# Altium schematic sheet sensors.SchDoc: Sensors
size A4; SheetNumber: 5; SheetTotal: 6
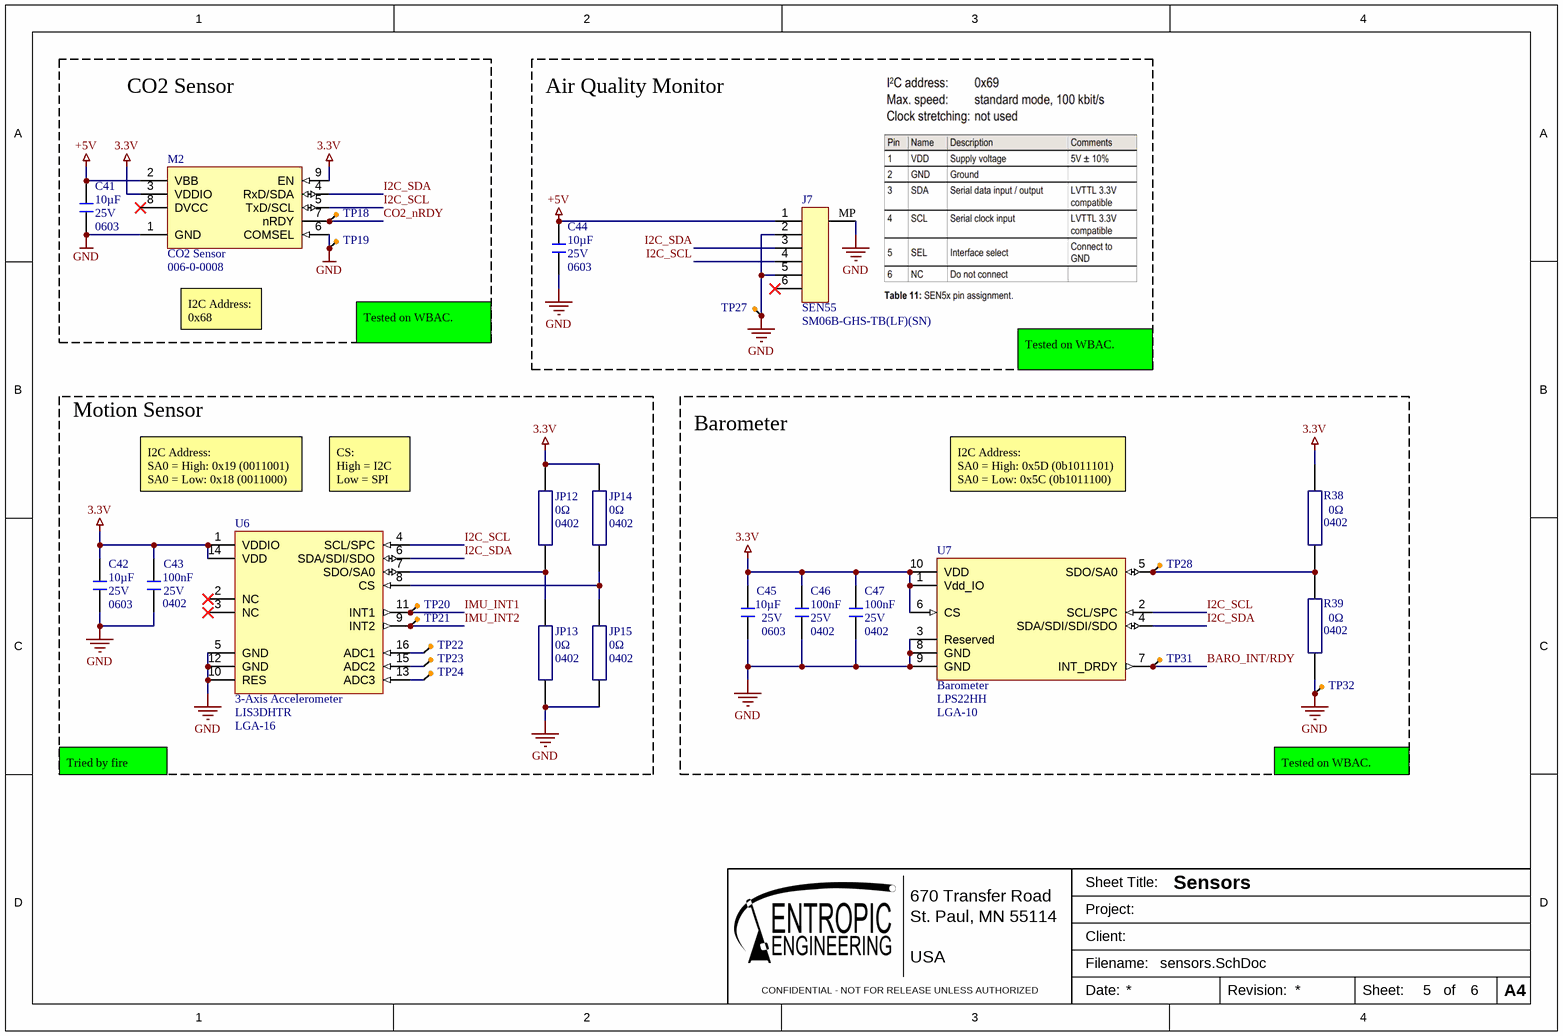
[diagram p0: sensors.SchDoc]

## Parts
C41  value 10µF  Case/Package: 0603  Voltage Rating: 25V  [0603_capacitor]  (hidden comment: CL10A106MA8NRNC)
C42  value 10µF  Case/Package: 0603  Voltage Rating: 25V  [0603_capacitor]  (hidden comment: CL10A106MA8NRNC)
C43  Case Code (Imperial): 0402  Voltage: 25V  Capacitance: 100nF  [0402_capacitor]  (hidden comment: GRM155R71E104KE14D)
C44  value 10µF  Case/Package: 0603  Voltage Rating: 25V  [0603_capacitor]  (hidden comment: CL10A106MA8NRNC)
C45  value 10µF  Voltage Rating: 25V  Case/Package: 0603  [0603_capacitor]  (hidden comment: CL10A106MA8NRNC)
C46  Case Code (Imperial): 0402  Voltage: 25V  Capacitance: 100nF  [0402_capacitor]  (hidden comment: GRM155R71E104KE14D)
C47  Case Code (Imperial): 0402  Voltage: 25V  Capacitance: 100nF  [0402_capacitor]  (hidden comment: GRM155R71E104KE14D)
J7  SEN55  [SM06B-GHS-TB]
JP12  value 0Ω  Case/Package: 0402  [0402_resistor]  (hidden comment: RC0402FR-070RL)
JP13  value 0Ω  Case/Package: 0402  [0402_resistor]  (hidden comment: RC0402FR-070RL)
JP14  value 0Ω  Case/Package: 0402  [0402_resistor]  (hidden comment: RC0402FR-070RL)
JP15  value 0Ω  Case/Package: 0402  [0402_resistor]  (hidden comment: RC0402FR-070RL)
M2  CO2 Sensor  [006-0-0008]
R38  value 0Ω  Case/Package: 0402  [0402_resistor]  (hidden comment: RC0402FR-070RL)
R39  value 0Ω  Case/Package: 0402  [0402_resistor]  (hidden comment: RC0402FR-070RL)
TP18  CO2_nRDY  [test_point-1]  (value not drawn)  (no BOM)
TP19  SENSOR_SDA  [test_point-1]  (value not drawn)  (no BOM)
TP20  test_point-1  [test_point-1]  (value not drawn)  (no BOM)
TP21  test_point-1  [test_point-1]  (value not drawn)  (no BOM)
TP22  test_point-1  [test_point-1]  (value not drawn)  (no BOM)
TP23  test_point-1  [test_point-1]  (value not drawn)  (no BOM)
TP24  test_point-1  [test_point-1]  (value not drawn)  (no BOM)
TP27  SENSOR_SDA  [test_point-1]  (value not drawn)  (no BOM)
TP28  SENSOR_SDA  [test_point-1]  (value not drawn)  (no BOM)
TP31  SENSOR_SCL  [test_point-1]  (value not drawn)  (no BOM)
TP32  SENSOR_SDA  [test_point-1]  (value not drawn)  (no BOM)
U6  3-Axis Accelerometer  Case/Package: LGA-16  [LGA50P300X300X100-16N]
U7  Barometer  Package: LGA-10  [LPS22]

## Blocks framed on the sheet
CO2 Sensor: C41 M2 TP18 TP19
Air Quality Monitor: C44 J7 TP27
Motion Sensor: C42 C43 JP12-JP15 TP20-TP24 U6
Barometer: C45-C47 R38 R39 TP28 TP31 TP32 U7

## Nets
3.3V: C42.2 C43.2 C45.2 C46.2 C47.2 JP12.1 JP14.1 M2.3(VDDIO) M2.9(EN) R38.1 U6.1(VDDIO) U6.14(VDD) U7.1(Vdd_IO) U7.6(CS) U7.10(VDD)
+5V: C41.2 C44.2 J7.1 M2.2(VBB)
GND: C41.1 C42.1 C43.1 C44.1 C45.1 C46.1 C47.1 J7.2 J7.5 J7.MP JP13.2 JP15.2 M2.1(GND) M2.6(COMSEL) R39.2 TP19.1 TP27.1 TP32.1 U6.5(GND) U6.10(RES) U6.12(GND) U7.3(Reserved) U7.8(GND) U7.9(GND)
BARO_INT/RDY: TP31.1 U7.7(INT_DRDY)
CO2_nRDY: M2.7(nRDY) TP18.1
I2C_SCL: J7.4 M2.5(TxD/SCL) U6.4(SCL/SPC) U7.2(SCL/SPC)
I2C_SDA: J7.3 M2.4(RxD/SDA) U6.6(SDA/SDI/SDO) U7.4(SDA/SDI/SDI/SDO)
IMU_INT1: TP20.1 U6.11(INT1)
IMU_INT2: TP21.1 U6.9(INT2)
NetJP12_2: JP12.2 JP13.1 U6.7(SDO/SA0)
NetJP14_2: JP14.2 JP15.1 U6.8(CS)
NetR38_2: R38.2 R39.1 TP28.1 U7.5(SDO/SA0)
NetTP22_1: TP22.1 U6.16(ADC1)
NetTP23_1: TP23.1 U6.15(ADC2)
NetTP24_1: TP24.1 U6.13(ADC3)

Not connected (* = marked no-connect by the designer): J7 6*; M2 8(DVCC)*; U6 2(NC)* 3(NC)*

## Notes on the sheet
- I2C Address:
  0x68
- Tested on WBAC.
- I2C Address:
  SA0 = High: 0x19 (0011001)
  SA0 = Low: 0x18 (0011000)
- CS:
  High = I2C
  Low = SPI
- I2C Address:
  SA0 = High: 0x5D (0b1011101)
  SA0 = Low: 0x5C (0b1011100)
- Tried by fire
- 670 Transfer Road
- St. Paul, MN 55114
- Sheet Title:
- Project:
- CONFIDENTIAL - NOT FOR RELEASE UNLESS AUTHORIZED
- USA
- Client:
- Filename:
- Date:
- Revision:
- Sheet:
- of
- A4

## Library data of the parts
C41 C42 C44 = CL10A106MA8NRNC: 10 µF, 25 V, X5R, 0603 Chip capacitor; Manufacturer: Samsung; house_part_number: C-10uF-0603-002; Tolerance: 20%; Material: 4241ConductorMaterial; RoHS: Yes; Category: Ceramic Capacitors; Case Code (Metric): 1608; Min Operating Temperature: -55°C; Max Operating Temperature: 85°C; Packaging: Cut Tape; RoHS Compliant: Yes; ComponentLink1URL: https://datasheet.ciiva.com/25766/cl10a106ma8nrnc-25766562.pdf?src-supplier=Digikey; ComponentLink1Description: https://datasheet.ciiva.com/25766/cl10a106ma8nrnc-25766562.pdf?src-supplier=Digikey; Manufacturer Part Number: CL10A106MA8NRNC; Case Code (Imperial): 0603; Stock: 632000; Pricing: 4000=0.0511, 8000=0.046, 12000=0.0434, 28000=0.0413, 100000=0.0356 (USD); Mounting Technology: Surface Mount; Series: CL; Height: 900um; Lead Free: Lead Free; Supplier Part Number 1: CL10A106MA8NRNC; Supplier 1: Arrow Electronics
C43 C46 C47 = GRM155R71E104KE14D: 100 nF, 25 V, X7R, 0402 Chip capacitor; Manufacturer: Murata; house_part_number: C-100nF-0402-002; Dielectric Material: Ceramic; Tolerance: 10%; Supplier 1: Digi-Key; Supplier Part Number 1: 490-10698-1-ND; RoHS: Yes; Category: Ceramic Capacitors; Pricing 1: 1=0.10000, 10=0.02700, 50=0.01460, 100=0.01190, 500=0.00848, 1000=0.00666, 2500=0.00605, 5000=0.00557 (USD); Mount: Surface Mount; Case/Package: 0402; Case Code (Metric): 1005; Weight: 0.000212oz; Min Operating Temperature: -55°C; Max Operating Temperature: 125°C; Packaging: Tape and Reel; Voltage Rating: 25V; Dielectric: X7R; Termination: SMD/SMT; Resistor Type: Ceramic; Voltage Rating (DC): 25V; Package Quantity: 10000; Length: 1mm; Width: 0.02inch; Height: 0.5mm; Thickness: 0.022inch; Depth: 0.5mm; REACH SVHC: Unknown; Lead Free: Lead Free; RoHS Compliant: Yes; ComponentLink1URL: http://www.farnell.com/datasheets/1872206.pdf?src-supplier=Farnell; ComponentLink1Description: http://www.farnell.com/datasheets/1872206.pdf?src-supplier=Farnell; ComponentLink2URL: http://components.arrow.com/part/dataview/0323_06361249?src-supplier=Arrow+Europe; ComponentLink2Description: http://components.arrow.com/part/dataview/0323_06361249?src-supplier=Arrow+Europe; ComponentLink3URL: http://uk.rs-online.com/webdocs/144c/0900766b8144c113.pdf?src-supplier=RSComponents; ComponentLink3Description: http://uk.rs-online.com/webdocs/144c/0900766b8144c113.pdf?src-supplier=RSComponents; ComponentLink4URL: http://www.farnell.com/datasheets/2048008.pdf?src-supplier=Farnell; ComponentLink4Description: http://www.farnell.com/datasheets/2048008.pdf?src-supplier=Farnell; ComponentLink5URL: http://www.mouser.com/ds/2/281/c02e-2905.pdf?src-supplier=Mouser; ComponentLink5Description: http://www.mouser.com/ds/2/281/c02e-2905.pdf?src-supplier=Mouser; ComponentLink6URL: http://www.farnell.com/datasheets/2048008.pdf?src-supplier=Newark; ComponentLink6Description: http://www.farnell.com/datasheets/2048008.pdf?src-supplier=Newark; ComponentLink7URL: https://search.murata.co.jp/Ceramy/image/img/A01X/G101/ENG/GRM155R71E104KE14-01.pdf?src-supplier=Digi-Key; ComponentLink7Description: https://search.murata.co.jp/Ceramy/image/img/A01X/G101/ENG/GRM155R71E104KE14-01.pdf?src-supplier=Digi-Key; ComponentLink8URL: http://www.farnell.com/datasheets/2048008.pdf?src-supplier=Element14; ComponentLink8Description: http://www.farnell.com/datasheets/2048008.pdf?src-supplier=Element14; ComponentLink9URL: http://psearch.en.murata.com/capacitor/product/GRM155R71E104KE14%23.pdf?src-supplier=Avnet; ComponentLink9Description: http://psearch.en.murata.com/capacitor/product/GRM155R71E104KE14%23.pdf?src-supplier=Avnet; Manufacturer Part Number: GRM155R71E104KE14D
C45 = CL10A106MA8NRNC: 10 µF, 25 V, X5R, 0603 Chip capacitor; Manufacturer: Samsung; house_part_number: C-10uF-0603-002; Material: 4241ConductorMaterial; Tolerance: 20%; Supplier 1: Arrow Electronics; Manufacturer Part Number: CL10A106MA8NRNC; RoHS: Yes; Category: Ceramic Capacitors; Case Code (Metric): 1608; Min Operating Temperature: -55°C; Max Operating Temperature: 85°C; Packaging: Cut Tape; Height: 900um; Lead Free: Lead Free; RoHS Compliant: Yes; ComponentLink1URL: https://datasheet.ciiva.com/25766/cl10a106ma8nrnc-25766562.pdf?src-supplier=Digikey; ComponentLink1Description: https://datasheet.ciiva.com/25766/cl10a106ma8nrnc-25766562.pdf?src-supplier=Digikey; Supplier Part Number 1: CL10A106MA8NRNC; Case Code (Imperial): 0603; Stock: 632000; Pricing: 4000=0.0511, 8000=0.046, 12000=0.0434, 28000=0.0413, 100000=0.0356 (USD); Mounting Technology: Surface Mount; Series: CL
J7 = SM06B-GHS-TB(LF)(SN): 6-Pin JST GH header, 1.25mm pitch, SMD right angle; Supplier 1: LCSC; Manufacturer: JST; RoHS: Yes; Category: Headers and Wire Housings; Stock 1: 1425; Pricing 1: 5=0.1587, 50=0.1251, 150=0.1087, 500=0.094, 2500=0.09, 5000=0.0876 (USD); ComponentLink1URL: https://datasheet.ciiva.com/25617/0900766b810cef18-25617251.pdf?src-supplier=Rs; ComponentLink1Description: https://datasheet.ciiva.com/25617/0900766b810cef18-25617251.pdf?src-supplier=Rs; ComponentLink2URL: https://datasheet.ciiva.com/16487/jstsm06b-ghs-tb-lf-sn-16487196.pdf?src-supplier=Future+Electronics; ComponentLink2Description: https://datasheet.ciiva.com/16487/jstsm06b-ghs-tb-lf-sn-16487196.pdf?src-supplier=Future+Electronics; Supplier Part Number 1: C133065; Manufacturer Part Number: SM06B-GHS-TB(LF)(SN)
JP12-JP15 = RC0402FR-070RL: 0 Ω, 0402 Chip resistor (jumper); Manufacturer: Yageo; house_part_number: R-0-0402-1%-001; Voltage Rating: 50V; Tolerance: 1%; Power Rating: 62.5mW; Temperature Coefficient: 200ppm/°C; Max Power Dissipation: 63mW; Manufacturer Part Number: RC0402FR-070RL; RoHS: Yes; Category: Chip SMD Resistors; Stock: 580000; Pricing: 10000=0.00093 (USD); Mounting Technology: Surface Mount; Contact Plating: Tin,Matte; Case Code (Imperial): 0402; Case Code (Metric): 1005; Min Operating Temperature: -55°C; Max Operating Temperature: 155°C; Packaging: Tape and Reel; Termination: SMD/SMT; Features: Moisture Resistant; Series: RC; Number of Terminations: 2; Length: 1mm; Width: 0.5mm; Height: 0.35mm; RoHS Compliant: Yes; Lead Free: 5697LeadFree; Supplier 1: Avnet; Supplier Part Number 1: RC0402FR-070RL
M2 = 006-0-0008: Sensair CO2 sensor; Manufacturer Part Number: 006-0-0008
R38 R39 = RC0402FR-070RL: 0 Ω, 0402 Chip resistor (jumper); Manufacturer: Yageo; house_part_number: R-0-0402-1%-001; Power Rating: 62.5mW; Max Power Dissipation: 63mW; Voltage Rating: 50V; Tolerance: 1%; Temperature Coefficient: 200ppm/°C; Supplier 1: Avnet; Supplier Part Number 1: RC0402FR-070RL; RoHS: Yes; Category: Chip SMD Resistors; Case Code (Metric): 1005; Case Code (Imperial): 0402; Contact Plating: Tin,Matte; Min Operating Temperature: -55°C; Max Operating Temperature: 155°C; Packaging: Tape and Reel; Number of Terminations: 2; Features: Moisture Resistant; Series: RC; Length: 1mm; Width: 0.5mm; Height: 0.35mm; Lead Free: 5697LeadFree; RoHS Compliant: Yes; Manufacturer Part Number: RC0402FR-070RL; Stock: 580000; Pricing: 10000=0.00093 (USD); Mounting Technology: Surface Mount; Termination: SMD/SMT
TP18-TP24 TP27 TP28 TP31 TP32 = test_point-1: Test point; pickable: no
U6 = LIS3DHTR: 3-Axis accelerometer, 16-bit, I2C/SPI, LGA-16; Manufacturer: STMicroelectronics; Max Supply Voltage: 3.6V; Min Supply Voltage: 1.71V; Operating Supply Voltage: 2.5V; Bandwidth: 5kHz; Interface: I2C,SPI; Resolution: 16b; Operating Supply Current: 11uA; Sensor Type: 3 Axis; Output Type: Digital; Axis: X, Y, Z; Supplier: Avnet; Supplier Part Number: LIS3DHTR; RoHS: Yes; Category: Accelerometers; Stock: 40000; Pricing: 4000=0.94095, 8000=0.92155, 16000=0.90215 (USD); Pins: 16; Min Operating Temperature: -40°C; Max Operating Temperature: 85°C; Package Quantity: 4000; Packaging: Tape and Reel; Max Supply Voltage (DC): 3.6V; Min Supply Voltage (DC): 1.71V; Series: -; Length: 3mm; Width: 3mm; Height: 1mm; Depth: 3mm; Radiation Hardening: No; Reach SVHC Compliant: No; Lead Free: Lead Free; RoHS Compliant: Yes; ComponentLink1URL: https://datasheet.ciiva.com/7621/1718591-7621744.pdf?src-supplier=Element14; ComponentLink1Description: https://datasheet.ciiva.com/7621/1718591-7621744.pdf?src-supplier=Element14; ComponentLink2URL: https://datasheet.ciiva.com/5296/cd00274221-117431-5296513.pdf?src-supplier=Mouser; ComponentLink2Description: https://datasheet.ciiva.com/5296/cd00274221-117431-5296513.pdf?src-supplier=Mouser; ComponentLink3URL: https://datasheet.ciiva.com/2810/cd00274221-2810009.pdf?src-supplier=Digikey; ComponentLink3Description: https://datasheet.ciiva.com/2810/cd00274221-2810009.pdf?src-supplier=Digikey; ComponentLink4URL: https://datasheet.ciiva.com/2810/cd00274221-2810008.pdf?src-supplier=Digikey; ComponentLink4Description: https://datasheet.ciiva.com/2810/cd00274221-2810008.pdf?src-supplier=Digikey; ComponentLink5URL: https://datasheet.ciiva.com/2810/cd00274221-2810010.pdf?src-supplier=Digikey; ComponentLink5Description: https://datasheet.ciiva.com/2810/cd00274221-2810010.pdf?src-supplier=Digikey; ComponentLink6URL: https://datasheet.ciiva.com/48495/cd00274221-48495849.pdf?src-supplier=Avnet; ComponentLink6Description: https://datasheet.ciiva.com/48495/cd00274221-48495849.pdf?src-supplier=Avnet; ComponentLink7URL: https://datasheet.ciiva.com/3271/cd00274221-3271807.pdf?src-supplier=Avnet; ComponentLink7Description: https://datasheet.ciiva.com/3271/cd00274221-3271807.pdf?src-supplier=Avnet; ComponentLink8URL: https://datasheet.ciiva.com/16216/cd00274221-16216362.pdf?src-supplier=Future+Electronics; ComponentLink8Description: https://datasheet.ciiva.com/16216/cd00274221-16216362.pdf?src-supplier=Future+Electronics; Manufacturer Part Number: LIS3DHTR; house_part_number: LIS3DHTR; Supplier 1: LCSC; Supplier Part Number 1: C15134
U7 = LPS22HH: 260-1260 hPa Absolute barometer, LGA-10; Manufacturer: STMicroelectronics; Sensor Type: PRESSURE SENSOR,PEIZORESISTIVE; Supplier 1: LCSC; RoHS: Yes; Category: Pressure Sensors; Stock 1: 7641; Pricing 1: 1=1.0244, 10=0.8712, 30=0.7877, 100=0.5824, 500=0.546, 1000=0.5304 (USD); Reach SVHC Compliant: Yes; RoHS Compliant: Yes; ComponentLink1URL: https://datasheet.ciiva.com:443/pdfs/VipMasterIC/IC/SGST/SGST-S-A0007383744/SGST-S-A0007383744-1.pdf?src-supplier=IHS+Markit; ComponentLink1Description: https://datasheet.ciiva.com:443/pdfs/VipMasterIC/IC/SGST/SGST-S-A0007383744/SGST-S-A0007383744-1.pdf?src-supplier=IHS+Markit; ComponentLink2URL: http://www.farnell.com/datasheets/2710908.pdf?src-supplier=Farnell; ComponentLink2Description: http://www.farnell.com/datasheets/2710908.pdf?src-supplier=Farnell; ComponentLink3URL: https://www.st.com/resource/en/datasheet/lps22hh.pdf?src-supplier=Digikey; ComponentLink3Description: https://www.st.com/resource/en/datasheet/lps22hh.pdf?src-supplier=Digikey; ComponentLink4URL: https://www.st.com/resource/en/data_brief/lps22hh.pdf?src-supplier=Digikey; ComponentLink4Description: https://www.st.com/resource/en/data_brief/lps22hh.pdf?src-supplier=Digikey; ComponentLink5URL: http://www.farnell.com/datasheets/2710908.pdf?src-supplier=Newark; ComponentLink5Description: http://www.farnell.com/datasheets/2710908.pdf?src-supplier=Newark; Supplier Part Number 1: C2827824; Manufacturer Part Number: LPS22HH